# Altium schematic sheet S7CAS-PLEIADES-CARTE-MERE_Pxx_DEBUG_USB.SchDoc
size Tabloid; SheetNumber: 8; SheetTotal: 18; Sheet_Name: DEBUG_USB; Size: 11x17
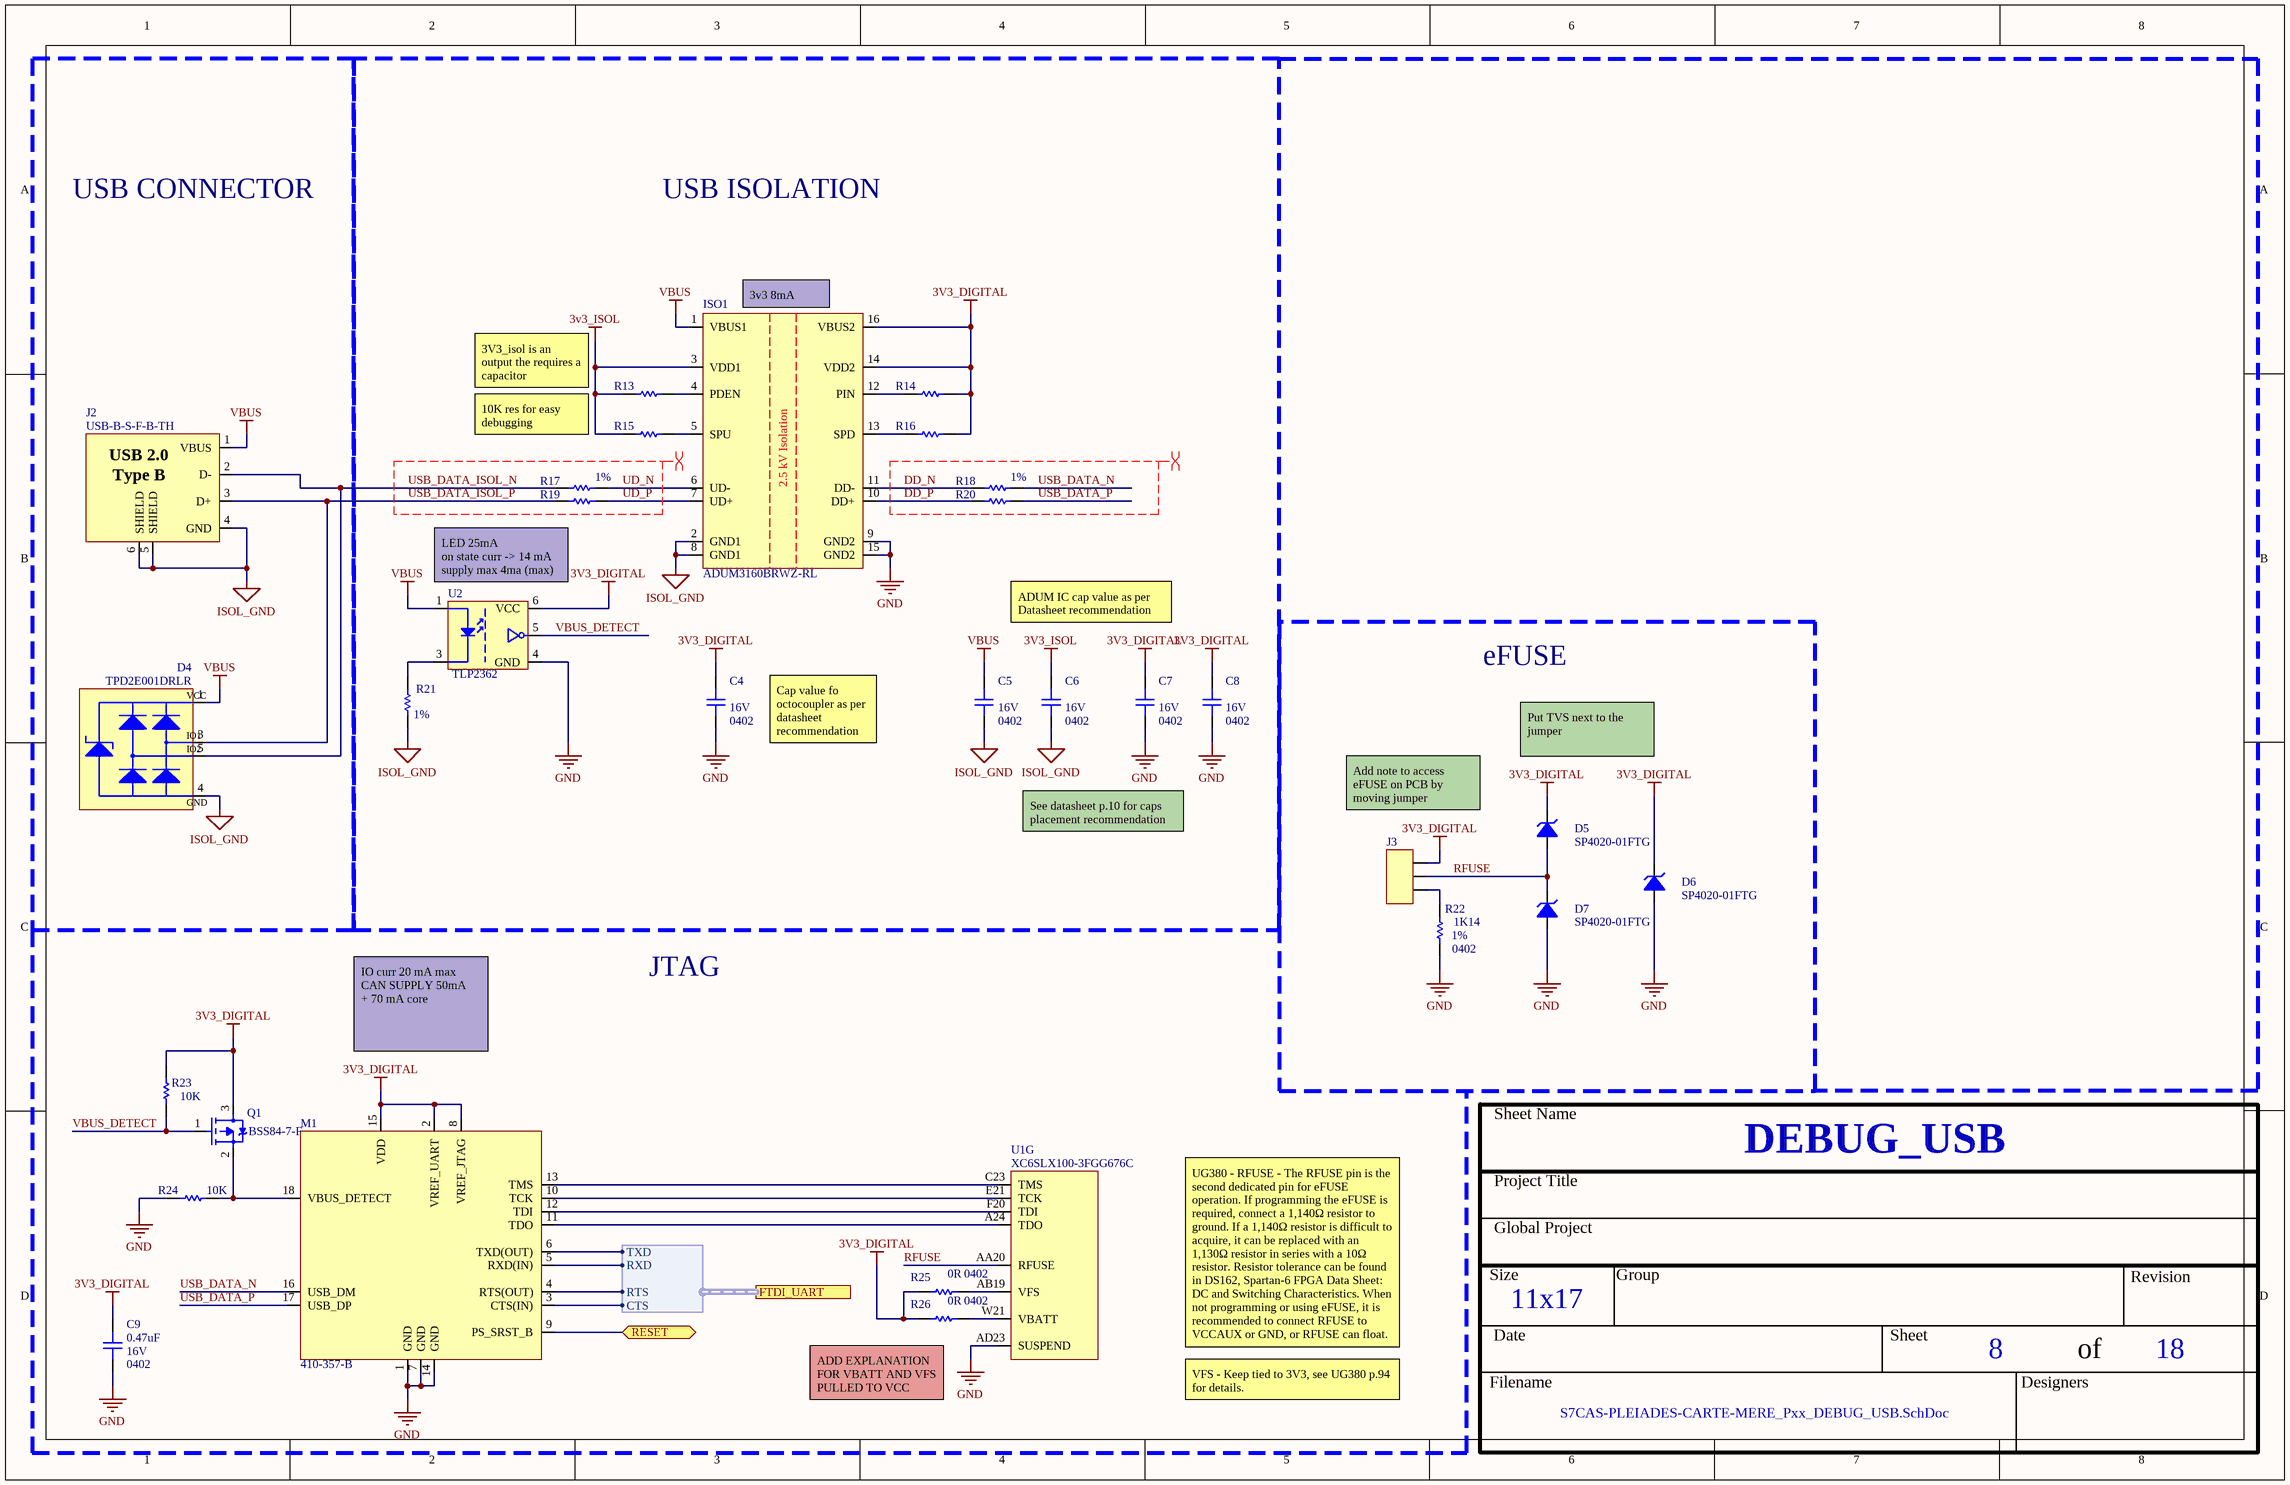
[diagram p0: S7CAS-PLEIADES-CARTE-MERE_Pxx_DEBUG_USB.SchDoc]

## Parts
C4  Voltage: 16V  [CAP_0402]  (hidden comment: 0402)
C5  Voltage: 16V  [CAP_0402]  (hidden comment: 0402)
C6  Voltage: 16V  [CAP_0402]  (hidden comment: 0402)
C7  Voltage: 16V  [CAP_0402]  (hidden comment: 0402)
C8  Voltage: 16V  [CAP_0402]  (hidden comment: 0402)
C9  value 0.47uF  Voltage: 16V  [CAP_0402]  (hidden comment: 0402)
D4  TPD2E001DRLR  [TVS_USB_TPD2E001DRLR]
D5  SP4020-01FTG  [SOD323 - UNIDIR]
D6  SP4020-01FTG  [SOD323 - UNIDIR]
D7  SP4020-01FTG  [SOD323 - UNIDIR]
ISO1  ADUM3160BRWZ-RL  [ISO_ADUM3160BRWZ-RL]
J2  USB-B-S-F-B-TH  [CON_USB_USB-B-S-F-B-TH]
J3  Part Number  [MALE HEADER - 1x3 2.54mm]  (value not drawn)
M1  410-357-B  [MOD_JTAG_410-357-B]
Q1  BSS84-7-F  [SOT23-3]
R13  RES - 0603  [RES_0402]  (value not drawn)
R14  RES - 0603  [RES_0402]  (value not drawn)
R15  RES - 0603  [RES_0402]  (value not drawn)
R16  RES - 0603  [RES_0402]  (value not drawn)
R17  Precision: 1%  [RES_0402]  (hidden comment: RES - 0402)
R18  Precision: 1%  [RES_0402]  (hidden comment: RES - 0402)
R19  RES - 0402  [RES_0402]  (value not drawn)
R20  RES - 0402  [RES_0402]  (value not drawn)
R21  Precision: 1%  [RES_0402]  (hidden comment: RES - 0603)
R22  value 1K14  Package: 0402  Precision: 1%  [RES_0402]  (hidden comment: RES - 0402)
R23  value 10K  [RES_0402]  (hidden comment: RES - 0603)
R24  value 10K  [RES_0402]  (hidden comment: RES - 0603)
R25  value 0R  Package: 0402  [RES_0402]  (hidden comment: RES - 0603)
R26  value 0R  Package: 0402  [RES_0402]  (hidden comment: RES - 0603)
U1  XC6SLX100-3FGG676C  [FPGA_XILINX_FGG676]  (part G of 10)
U2  TLP2362  [OPTO_TLP2362]

## Blocks framed on the sheet
USB CONNECTOR: D4 J2
USB ISOLATION: C4-C8 ISO1 R13-R21 U2
eFUSE: D5-D7 J3 R22

## Ports
FTDI_UART (harness FTDI_HARNESS, see S7CAS-PLEIADES-CARTE-MERE_Pxx_FPGA_bank2_4[6A]), RESET (bidir, see S7CAS-PLEIADES-CARTE-MERE_Pxx_FPGA_bank2_4[6C])

## Harnesses
FTDI_HARNESS: TXD, RXD, RTS, CTS

## Nets
3V3_DIGITAL: C4.2 C7.2 C8.2 C9.2 D5.1 D6.1 ISO1.14(VDD2) ISO1.16(VBUS2) J3.1 M1.2(VREF_UART) M1.8(VREF_JTAG) M1.15(VDD) Q1.3 R14.1 R16.1 R23.2 R25.2 R26.2 U2.6(VCC)
3v3_ISOL: C6.2 ISO1.3(VDD1) R13.2 R15.2
GND: C4.1 C7.1 C8.1 C9.1 D6.2 D7.2 ISO1.9(GND2) ISO1.15(GND2) M1.1(GND) M1.7(GND) M1.14(GND) R22.1 R24.1 U1.AD23(SUSPEND) U2.4(GND)
ISOL_GND: C5.1 C6.1 D4.4(GND) ISO1.2(GND1) ISO1.8(GND1) J2.4(GND) J2.5(SHIELD) J2.6(SHIELD) R21.1
VBUS: C5.2 D4.1(VCC) ISO1.1(VBUS1) J2.1(VBUS) U2.1
DD_N: ISO1.11(DD-) R18.2
DD_P: ISO1.10(DD+) R20.2
RESET: M1.9(PS_SRST_B) ; port RESET
RFUSE: D5.2 D7.1 J3.2 U1.AA20(RFUSE)
UD_N: ISO1.6(UD-) R17.1
UD_P: ISO1.7(UD+) R19.1
USB_DATA_ISOL_N: D4.5(IO2) J2.2(D-) R17.2
USB_DATA_ISOL_P: D4.3(IO1) J2.3(D+) R19.2
USB_DATA_N: M1.16(USB_DM) R18.1
USB_DATA_P: M1.17(USB_DP) R20.1
VBUS_DETECT: Q1.1 R23.1 U2.5(vout)
NetISO1_4: ISO1.4(PDEN) R13.1
NetISO1_5: ISO1.5(SPU) R15.1
NetISO1_12: ISO1.12(PIN) R14.2
NetISO1_13: ISO1.13(SPD) R16.2
NetJ3_3: J3.3 R22.2
NetM1_3: M1.3(CTS(IN)) ; port FTDI_UART.CTS
NetM1_4: M1.4(RTS(OUT)) ; port FTDI_UART.RTS
NetM1_5: M1.5(RXD(IN)) ; port FTDI_UART.RXD
NetM1_6: M1.6(TXD(OUT)) ; port FTDI_UART.TXD
NetM1_10: M1.10(TCK) U1.E21(TCK)
NetM1_11: M1.11(TDO) U1.A24(TDO)
NetM1_12: M1.12(TDI) U1.F20(TDI)
NetM1_13: M1.13(TMS) U1.C23(TMS)
NetM1_18: M1.18(VBUS_DETECT) Q1.2 R24.2
NetR21_2: R21.2 U2.3
NetR25_1: R25.1 U1.AB19(VFS)
NetR26_1: R26.1 U1.W21(VBATT)

Not connected (* = marked no-connect by the designer): D4 2(NC)

## Layout directives
differential pair; differential pair class USB_DATA_PAIR; differential pair class USB_90OHM: UD_N, UD_P, USB_DATA_ISOL_N, USB_DATA_ISOL_P
differential pair; differential pair class USB_90OHM: DD_N, DD_P, USB_DATA_N, USB_DATA_P

## Notes on the sheet
- (near ISO1) 3v3 8mA
- 3V3_isol is an output the requires a capacitor
- 10K res for easy debugging
- LED 25mA
  on state curr -> 14 mA
  supply max 4ma (max)
- ADUM IC cap value as per Datasheet recommendation
- Cap value fo octocoupler as per datasheet recommendation
- Put TVS next to the jumper
- See datasheet p.10 for caps placement recommendation
- Add note to access eFUSE on PCB by moving jumper
- JTAG
- IO curr 20 mA max
  CAN SUPPLY 50mA
  + 70 mA core
- UG380 - RFUSE - The RFUSE pin is the second dedicated pin for eFUSE operation. If programming the eFUSE is required, connect a 1,140Ω resistor to ground. If a 1,140Ω resistor is difficult to acquire, it can be replaced with an 1,130Ω resistor in series with a 10Ω resistor. Resistor tolerance can be found in DS162, Spartan-6 FPGA Data Sheet: DC and Switching Characteristics. When not programming or using eFUSE, it is recommended to connect RFUSE to VCCAUX or GND, or RFUSE can float.
- (near R26) ADD EXPLANATION FOR VBATT AND VFS PULLED TO VCC
- VFS - Keep tied to 3V3, see UG380 p.94 for details.
- Sheet Name
- Project Title
- Global Project
- Size
- Group
- Revision
- Date
- Sheet
- of
- Filename
- Designers
- (in symbol CON_USB_USB-B-S-F-B-TH) USB 2.0; Type B
- (in symbol ISO_ADUM3160BRWZ-RL) 2.5 kV Isolation

## Library data of the parts
C4-C9 = CAP - 0603: CAP - 0402; Precision: 10%; Current: *; CreatedBy: Jonathan Bouchard; Power: *; Package: 0402; Supplier 1: Arrow Electronics
  C4: Supplier Part Number 1: CL10B104KO8NNNC; Parameter 1: *
  C5-C8: Supplier Part Number 1: C1608X7R1C474K080AC; Parameter 1: *
  C9: Supplier Part Number 1: C1608X7R1C474K080AC
D4 = TVS_USB_TPD2E001DRLR: TVS - USB TVS DIODE 5.5V - SOT-553; Manufacturer #1: Texas Instruments; Voltage Rating: 5.5V (Max); GRAMS Lib Spec: 2.8; Magnetic Material: YES; Cryo: UNKNOWN; Tolerance: *; Current Rating: *; Power Max: *; HelpURL: http://www.ti.com/lit/ds/symlink/tpd2e001.pdf; CreatedBy/Date: Jonathan Bouchard 2018-07-10; VerifiedBy: Arnaud Samson 16-07-18; Temperature: -40°C ~ 85°C (TA); Package: SOT-553; Manufacturer #2: *; Note: *; Assembly Type: SMD; Part Number #2: *; Part Number #1: TPD2E001DRLR; Polarized: YES; Supplier 1: Digi-Key; Supplier Part Number 1: 296-21883-1-ND; Parameter 1: *
D5-D7 = TVS_SP4020-01FTG: TVS - 3.3VWM 21.8V (Typ) Clamp 30A (8/20µs) Ipp Tvs Diode Surface Mount SOD-323; GRAMS Lib Spec: 2.7; Supplier 1: Future Electronics; Supplier Part Number 1: 6058247
ISO1 = ISO_ADUM3160BRWZ-RL: ISO - DGTL ISO 2.5KV 2CH USB - 16SOIC; Manufacturer #1: Analog Devices; Voltage Rating: 3~5.5V; GRAMS Lib Spec: 2.8; Magnetic Material: UNKNOWN; Polarized: Yes; Tolerance: *; Current Rating: *; Power Max: *; HelpURL: https://www.analog.com/media/en/technical-documentation/data-sheets/ADuM3160.pdf; CreatedBy/Date: Tommy Rossignol 2018-11-16; VerifiedBy: Caroline Paulin - 13 février 2019; Temperature: -40°C ~ 105°C; Package: 16-SOIC; Manufacturer #2: *; Assembly Type: SMD; Part Number #2: *; Part Number #1: ADUM3160BRWZ-RL; Supplier 1: Digi-Key; Supplier Part Number 1: ADUM3160BRWZ-RLCT-ND; Cryo: UNKNOWN; Parameter 1: *
J2 = CON_USB_USB-B-S-F-B-TH: CON - USB B RECPT TH R/A - 4-TH; Manufacturer #1: Samtec Inc.; Voltage Rating: 30VAC; GRAMS Lib Spec: 2.8c; Magnetic Material: UNKNOWN; Polarized: YES; Tolerance: *; Current Rating: *; Power Max: *; HelpURL: http://suddendocs.samtec.com/catalog_english/usb_b.pdf; CreatedBy/Date: Jonathan Bouchard 2020-03-24; VerifiedBy: C.Paulin - 22/04/2020; Temperature: -50°C ~ 85°C; Package: 4-TH; Manufacturer #2: *; Note: *; Assembly Type: TH; Part Number #2: *; Part Number #1: USB-B-S-F-B-TH; Supplier 1: Digi-Key; Supplier Part Number 1: SAM10867-ND; Cryo: UNKNOWN; Parameter 1: *
J3 = MALE HEADER - 1x3 2.54mm: MALE HEADER - 2.54mm 1x2; GRAMS Lib Spec: 2.7
M1 = MOD_JTAG_410-357-B: MOD - JTAG-SMT3-NC Programming Module For Xilinx FPGA - 18-SMT; Manufacturer #1: Digilent; Voltage Rating: VDD: 2.97V~3.63V, VJTAG/VUART: 1.65V~5.5V; GRAMS Lib Spec: 2.8; Note: Prior to reflow, the JTAG-SMT3-NC module must be dried at 125°C for 17 hours; Magnetic Material: Unknown; Polarized: Yes; Value: *; Tolerance: *; Current Rating: *; Power Max: *; HelpURL: https://reference.digilentinc.com/_media/reference/programmers/jtag-smt3/jtag-smt3-nc_rm.pdf; CreatedBy/Date: Tommy Rossignol 2018-11-23; VerifiedBy: Nicolas V. (2019-01-28); Temperature: -40°C ~ 85°C; Package: 18-pad SMT; Manufacturer #2: *; Assembly Type: SMD; Part Number #2: *; Part Number #1: 410-357-B; Supplier 1: Digi-Key; Supplier Part Number 1: 1286-1196-ND; Cryo: UNKNOWN
Q1 = MOS_P_CHANNEL: P-Channel  Enhancement Mode Field Effect Transistor; Current: [Current]; Mfr: *; Package / Case: *; Vds: *; Rds ON: *; Vgs: *; Operating Temperature: *; Supplier 1: Future Electronics; Supplier Part Number 1: 2984037
R13-R16 R23-R26 = RES - 0603: RES - 0402; Precision: 1%; Current: *; CreatedBy: Jonathan Bouchard; Supplier 1: Arrow Electronics
  R13-R16: Package: 0402; Supplier Part Number 1: RMCF0603FT10K0; Parameter 1: *
  R23 R24: Package: 0402; Supplier Part Number 1: RMCF0603FT10K0
  R25 R26: Supplier Part Number 1: RMCF0603ZT0R00
R17 R18 R22 = RES - 0402: Voltage: 50V; Power: 1/16W; Current: *; CreatedBy: Jonathan Bouchard
  R17 R18: Package: 0402; Supplier 1: Arrow Electronics; Supplier Part Number 1: RC0402FR-0724RL; Parameter 1: *
  R22: Supplier 1: Digikey; Supplier Part Number 1: 2019-RN73H1ETTP1141F50CT-ND
R19 R20 = RES - 0402: Voltage: 50V; Power: 1/16W; Precision: 1%; Current: *; CreatedBy: Jonathan Bouchard; Package: 0402; Supplier 1: Arrow Electronics; Supplier Part Number 1: RC0402FR-0724RL; Parameter 1: *
R21 = RES - 0603: RES - 0402; Current: *; CreatedBy: Jonathan Bouchard; Package: 0402; Supplier 1: Arrow Electronics; Supplier Part Number 1: RMCF0603FT100R; Parameter 1: *
U1 = FPGA_XC6SLX100-3FGG676C: FPGA - XILINX SPARTAN 6 480 I/O - BGA-676; Voltage: 1.14 V ~ 1.26 V; Current: *; Power: *; Mfg: Xilinx; Mfg Part Number: XC6SLX100-3FGG676C; HelpURL: https://www.xilinx.com/support/documentation/data_sheets/ds162.pdf; CreatedBy: Jonathan Bouchard; Temperature: 0°C ~ 85°C (TJ); Value: *; Precision: *; Package: BGA-676; Supplier 1: Digikey; Supplier Part Number 1: 122-1760-ND
U2 = PHOTO_COUP_TLP2362: ISO - Logic Output Optoisolator 10MBd Open Collector 3750Vrms 1 Channel 20kV/µs CMTI 6-SO, 5 Lead; GRAMS Lib Spec: 2.7; Supplier 1: Arrow Electronics; Supplier Part Number 1: TLP2362(TPR,E; Parameter 1: *